# EasyEDA schematic SCH_dito_2026-01-28.json

## Sheets
1 Sheet_1: TITLE: Sheet_1; REV: 1.0; Date: 2026-01-20; Sheet: 1/1; Drawn By: siudin22; Company: Your Company
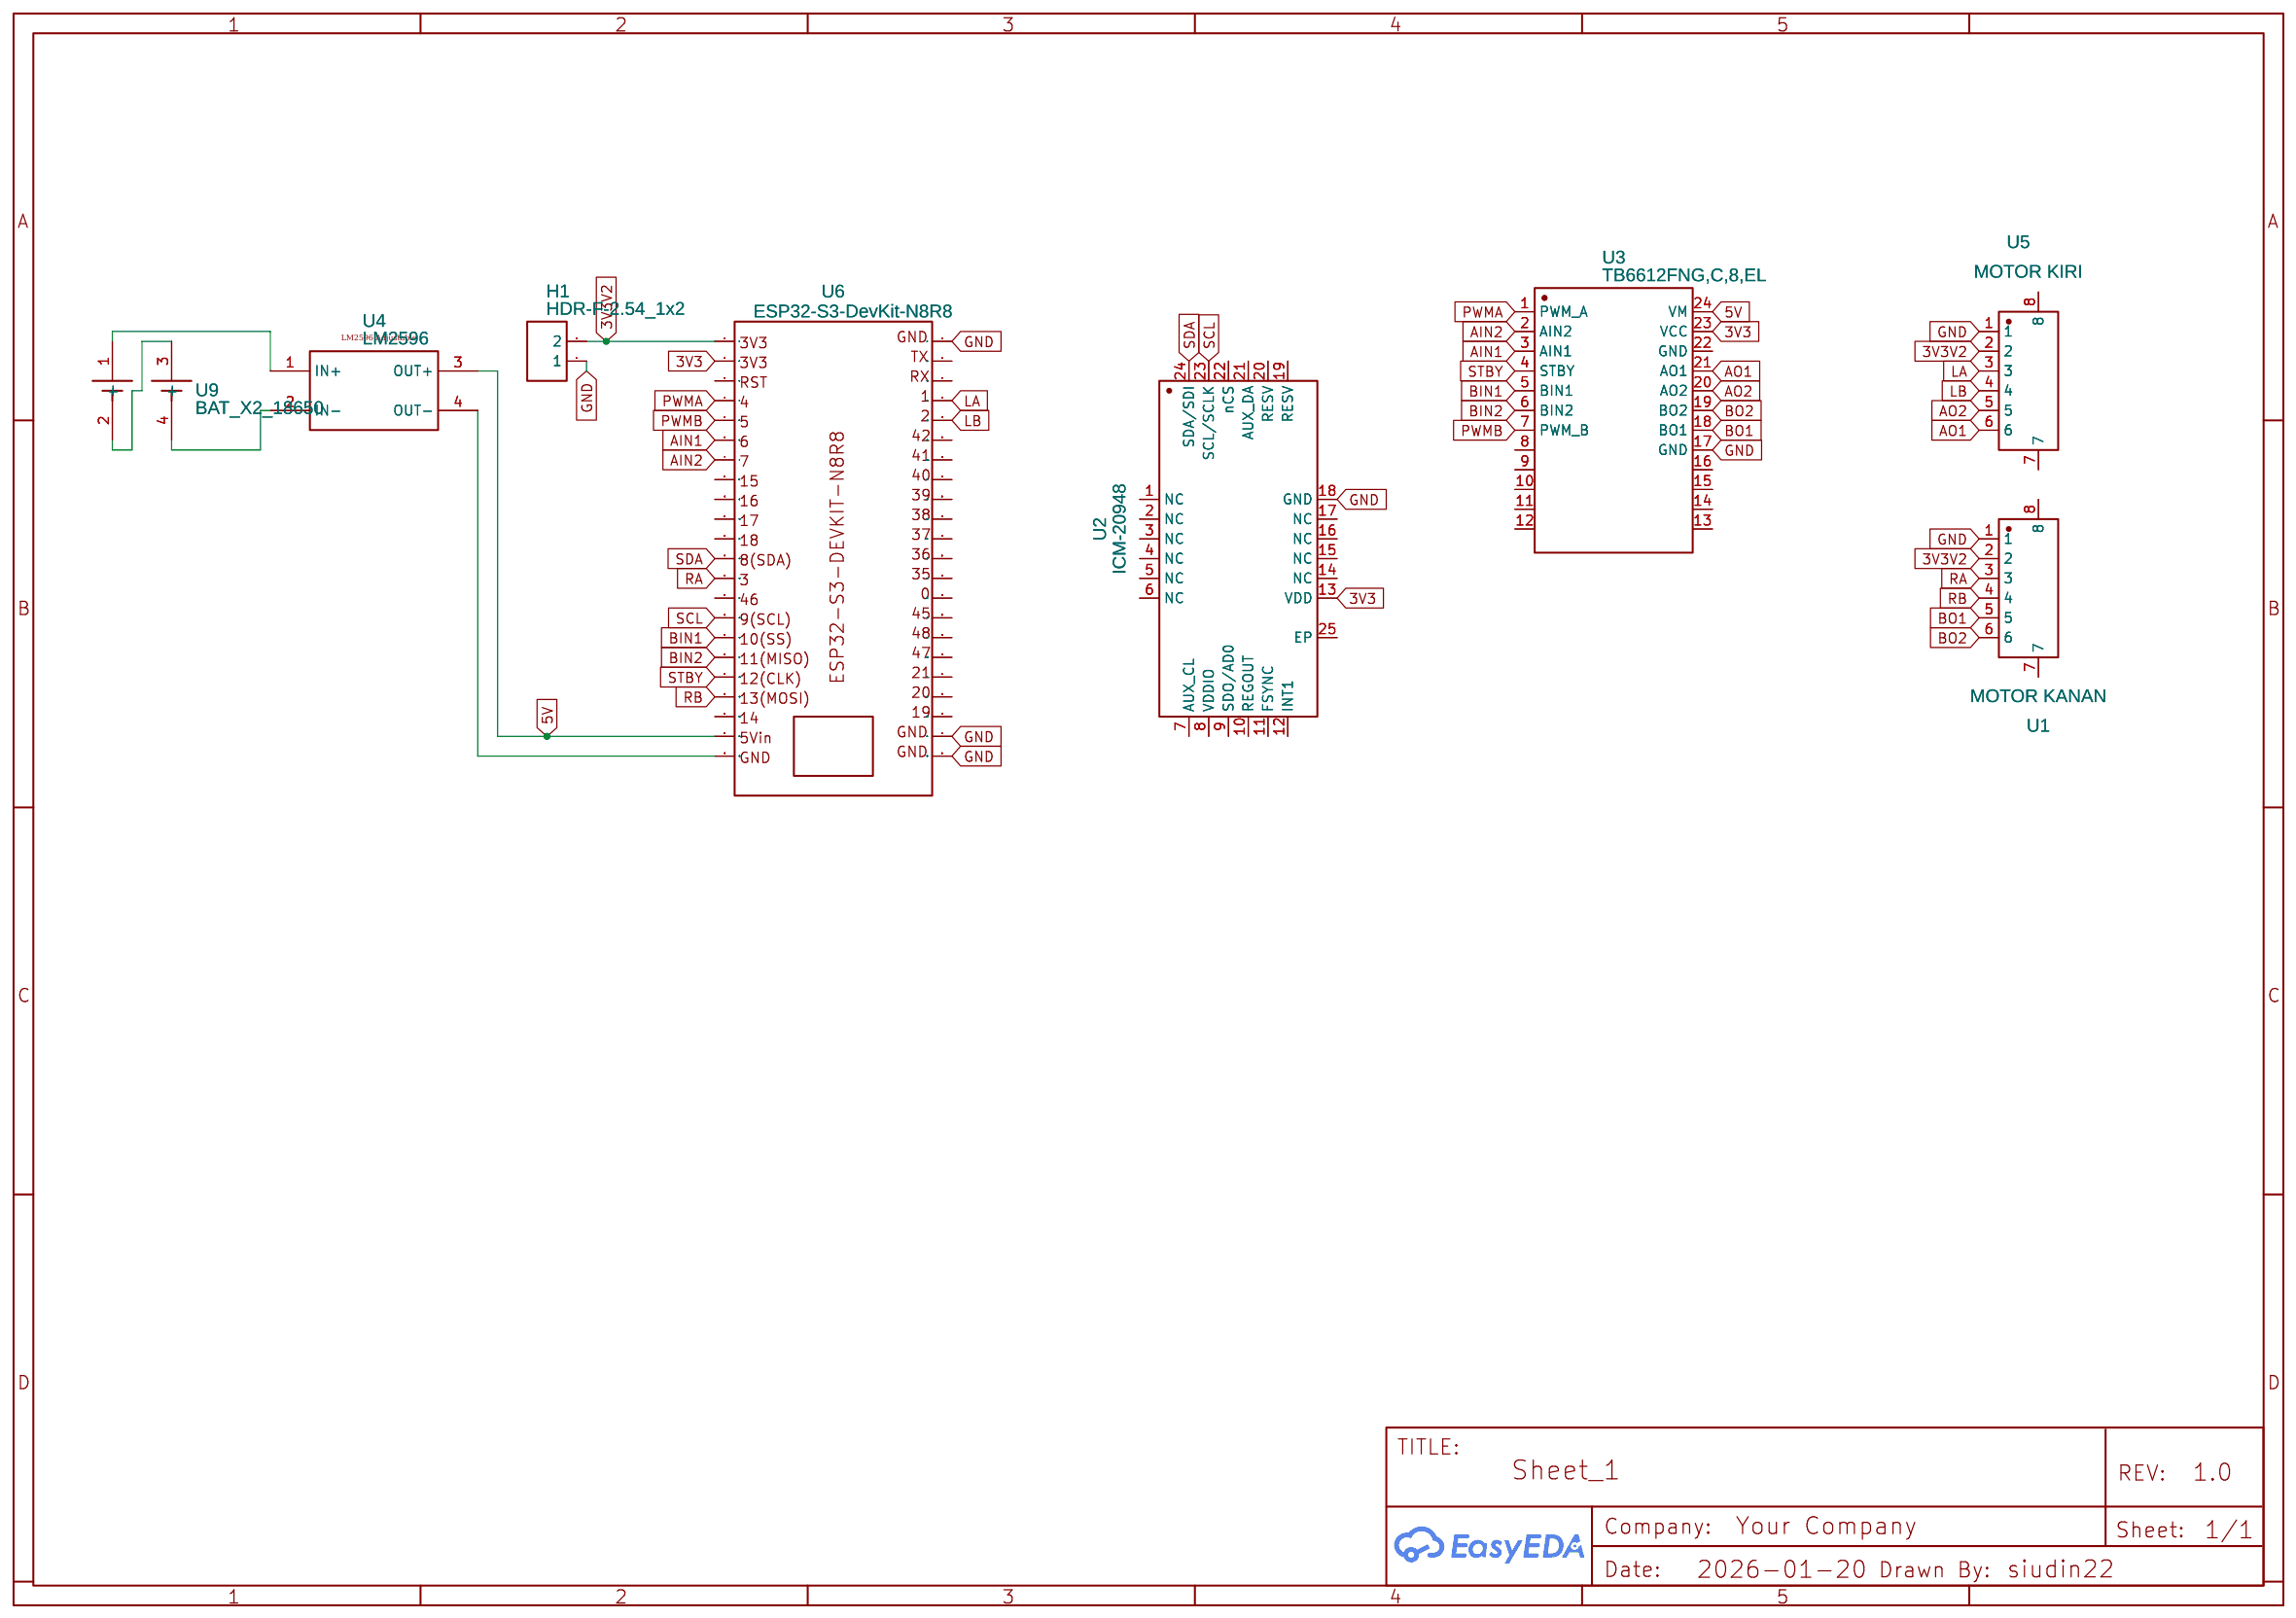
[diagram p0: Sheet_1]
2 Sheet_2: TITLE: Sheet_2; Date: 2026-01-22
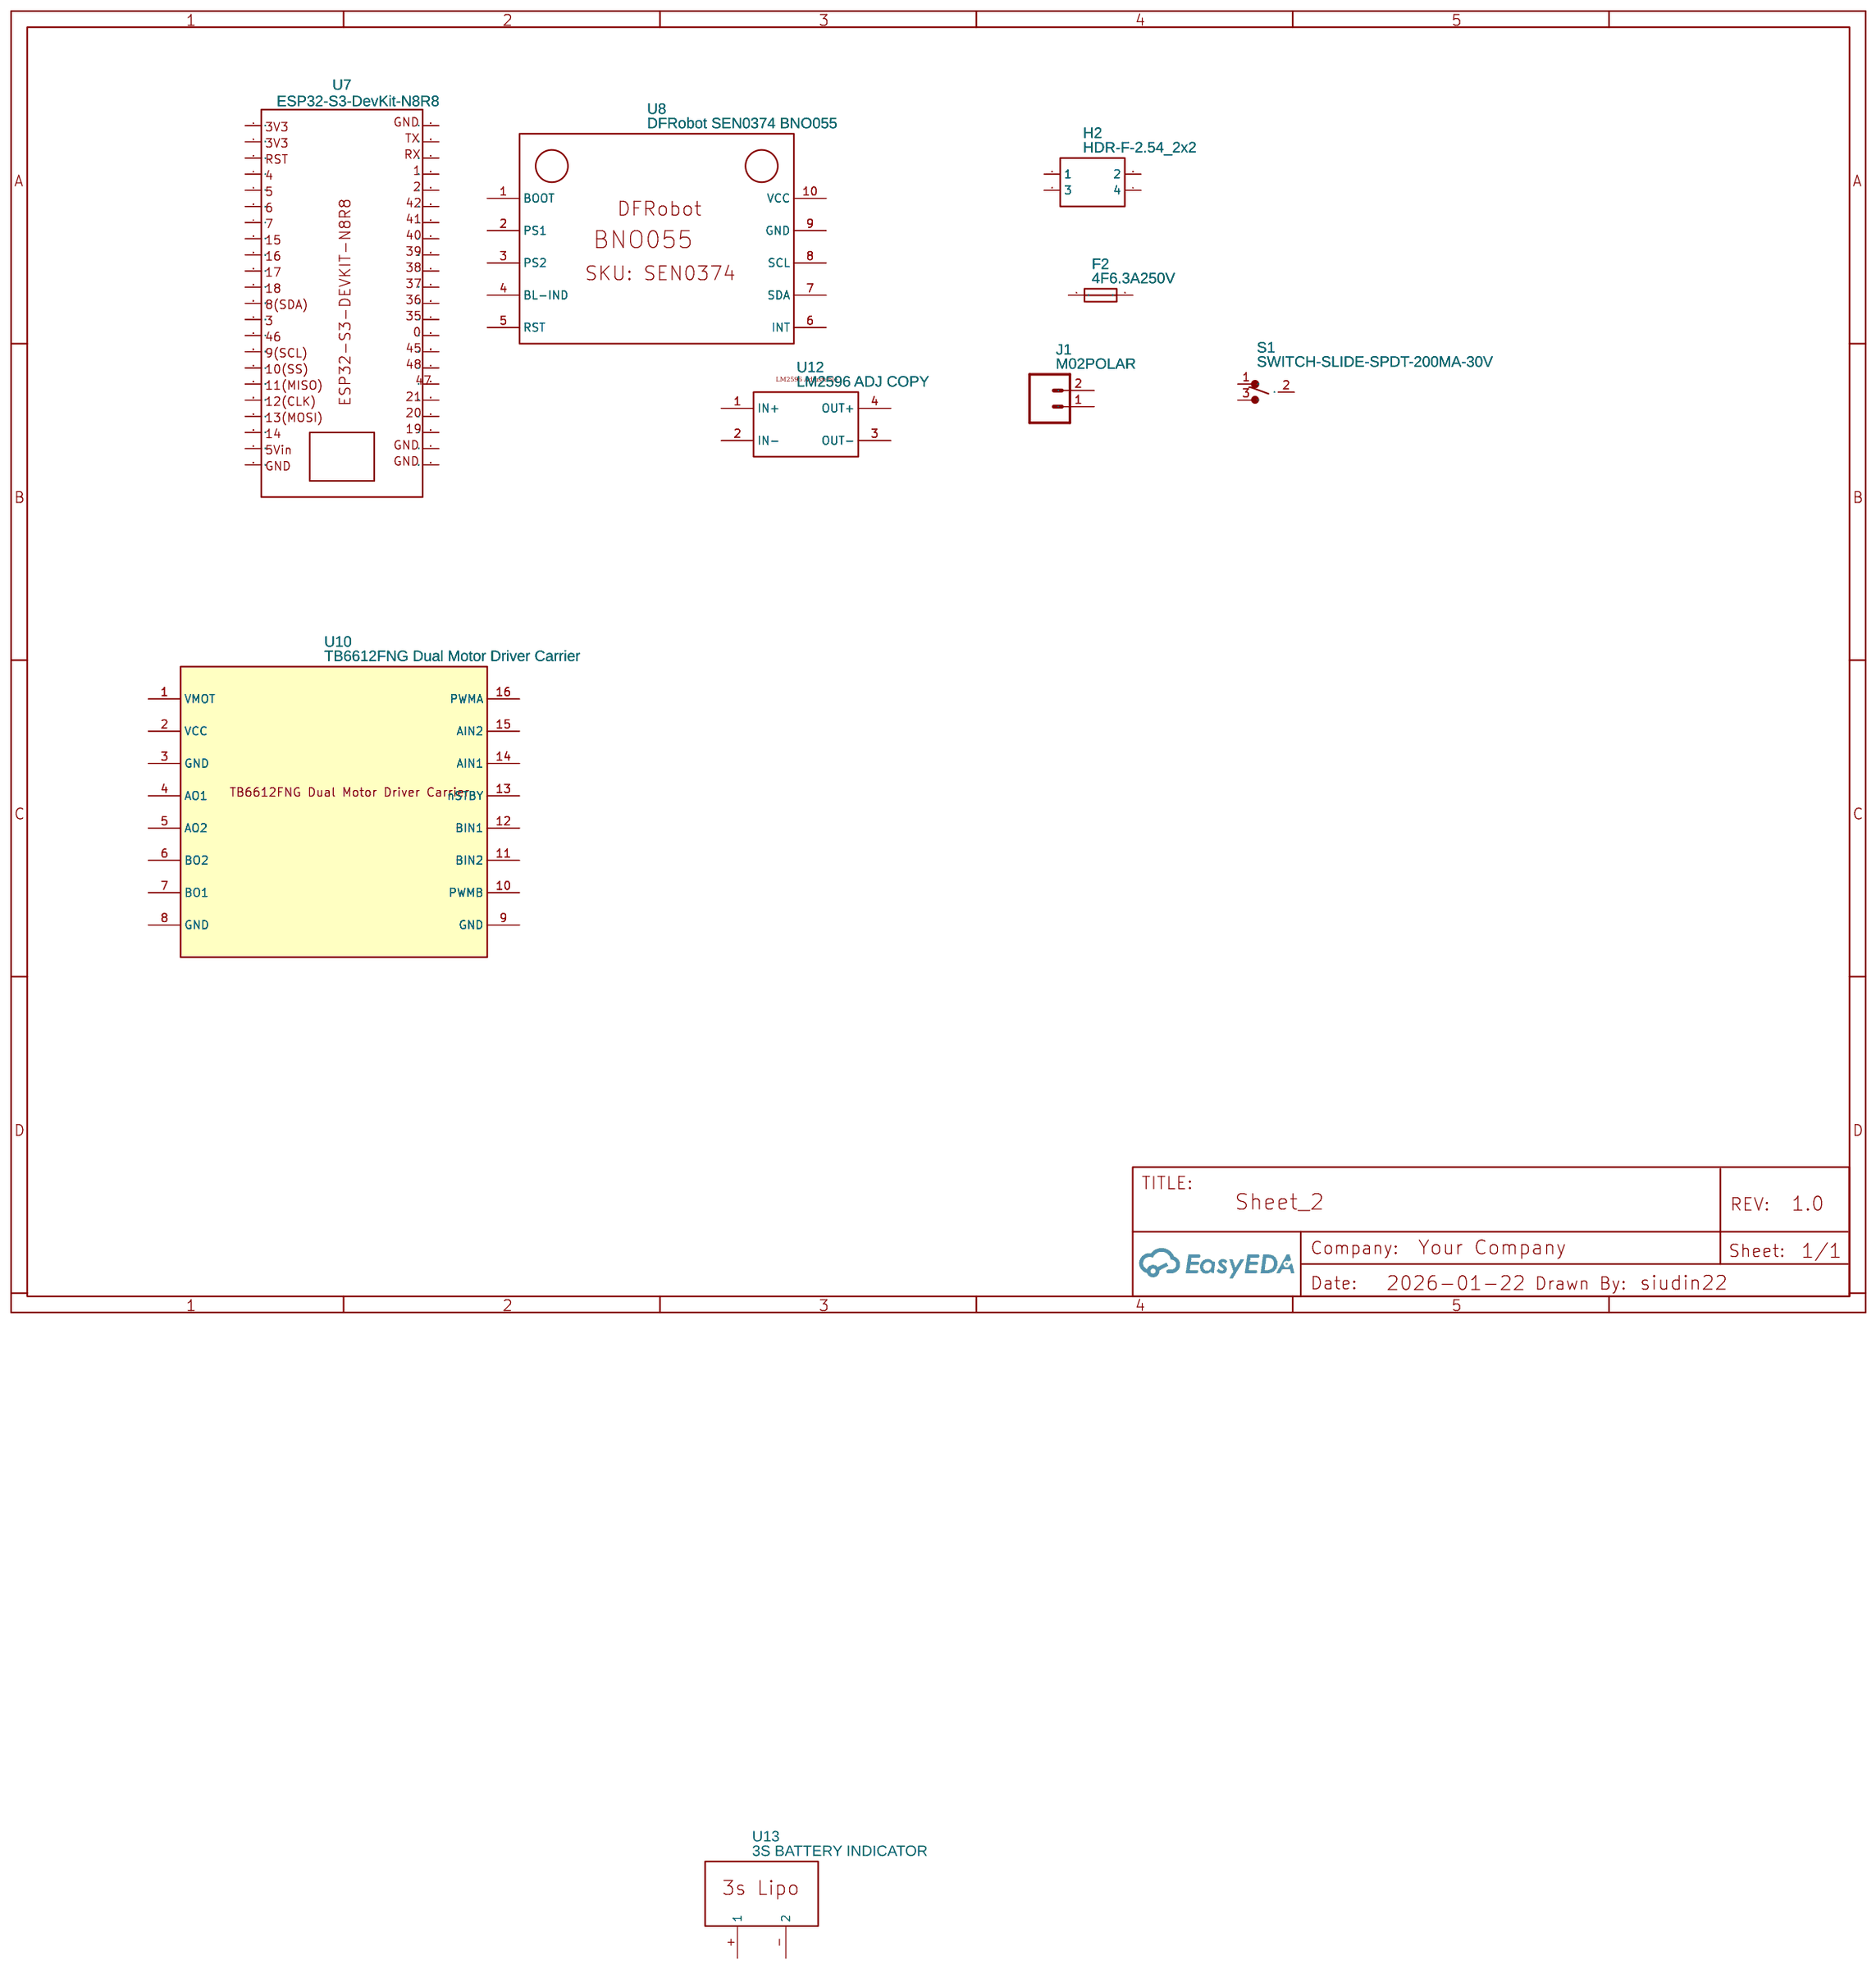
[diagram p1: Sheet_2]

## Parts
sheet Sheet_1
H1  HDR-F-2.54_1x2  [HDR-F-2.54_1X2]
U1  MOTOR KANAN  [CONN-SMD_6P-P1.00_XYECONN_XY-SH1.0-6A61]
U2  ICM-20948  [QFN-24_L3.0-W3.0-P0.40-BL-EP]
U3  TB6612FNG,C,8,EL  [SSOP-24_L8.3-W5.6-P0.65-LS7.6-BL]
U4  LM2596  [LM2596:YAAJ_DCDC_STEPDOWN_LM2596]
U5  MOTOR KIRI  [CONN-SMD_6P-P1.00_XYECONN_XY-SH1.0-6A61]
U6  ESP32-S3-DevKit-N8R8  [ESP32-S3-DEVKIT-N8R8]
U9  BAT_X2_18650  [BAT_X2_18650_ROUN_PAD_72X19]
sheet Sheet_2
F2  4F6.3A250V  [FUSE-TH_BD4.0-L11.0-P15.00-D0.6]
H2  HDR-F-2.54_2x2  [HDR-F-2.54_2X2]
J1  M02POLAR  [MOLEX-1X2]
S1  SWITCH-SLIDE-SPDT-200MA-30V  [SWITCH-ESWITCH-SLIDE-TH-EG1218]
U7  ESP32-S3-DevKit-N8R8  [ESP32-S3-DEVKIT-N8R8]
U8  DFRobot SEN0374 BNO055  [FOOTPRINT DFROBOT SEN0374 BNO055]
U10  TB6612FNG Dual Motor Driver Carrier  [TB6612FNG]
U12  LM2596 ADJ COPY  [LM2596:YAAJ_DCDC_STEPDOWN_LM2596]
U13  3S BATTERY INDICATOR  [3S LIPO BATTERY INDICATOR]

## Library data of the parts
H1 = HDR-F-2.54_1x2: Supplier Part: C49661; Supplier: LCSC; Contributor: LCEDA_Lib
U1 U5 = XY-SH1.0-6A61: Supplier: LCSC; Supplier Part: C19272000; Manufacturer: XYECONN(辛译); Contributor: lcsc
U2 = ICM-20948: Contributor: lcsc; Supplier: LCSC; Supplier Part: C726001; Manufacturer: TDK InvenSense(应美盛); JLCPCB Part Class: Extended Part
U3 = TB6612FNG,C,8,EL: Contributor: LCSC; Supplier: LCSC; Manufacturer: TOSHIBA(东芝); Supplier Part: C141517; JLCPCB Part Class: Extended Part
U4 = BuckConverters_LM2596_Adj: Servo 5V; Add into BOM: yes; Convert to PCB: yes; Origin Footprint: YAAJ_DCDC_StepDown_LM2596; Contributor: ee22b001
U6 U7 = ESP32-S3-DevKit-N8R8: Manufacturer: WaveShare; Supplier: Mouser; link: https://www.waveshare.com/wiki/ESP32-S3-DEV-KIT-N8R8; Contributor: robciog1968
U9 = BAT_X2_18650: Manufacturer: Dex; Supplier: Dex; Supplier Part: BAT_X2; Contributor: DexterityG
F2 = 4F6.3A250V: Contributor: lcsc; Supplier: LCSC; Supplier Part: C2905522; Manufacturer: xcfuse(旭程); JLCPCB Part Class: Extended Part
H2 = HDR-F-2.54_2x2: Supplier Part: C239342; Supplier: LCSC; Contributor: LCEDA_Lib
J1 = M02POLAR: Contributor: firefalc0n
S1 = SWITCH-SLIDE-SPDT-200MA-30V: Contributor: gokmenim
U8 = DFRobot SEN0374 BNO055: Contributor: huynhquoctoan26
U10 = TB6612FNG Dual Motor Driver Carrier: Contributor: jazmin.trejo.p; sourceId: YsmgyP7pj; Mounted: Yes
U12 = BuckConverters_LM2596_Adj: Servo 5V; Add into BOM: yes; Convert to PCB: yes; Origin Footprint: YAAJ_DCDC_StepDown_LM2596; Contributor: ottello
U13 = 3S BATTERY INDICATOR: Contributor: Atly Joy

## Nets
3V3: U2.13(VDD) U3.23(VCC) U6.2
3V3V2: H1.2 U1.2 U5.2 U6.1
5V: U3.24(VM) U4.3(OUT+) U6.21
GND: H1.1 U1.1 U2.18(GND) U3.17(GND) U5.1 U6.23 U6.24 U6.44
AIN1: U3.3(AIN1) U6.6
AIN2: U3.2(AIN2) U6.7
AO1: U3.21(AO1) U5.6
AO2: U3.20(AO2) U5.5
BIN1: U3.5(BIN1) U6.16
BIN2: U3.6(BIN2) U6.17
BO1: U1.5 U3.18(BO1)
BO2: U1.6 U3.19(BO2)
LA: U5.3 U6.41
LB: U5.4 U6.40
PWMA: U3.1(PWM A) U6.4
PWMB: U3.7(PWM B) U6.5
RA: U1.3 U6.13
RB: U1.4 U6.19
SCL: U2.23(SCL/SCLK) U6.15
SDA: U2.24(SDA/SDI) U6.12
STBY: U3.4(STBY) U6.18
Net-(U4-1): U4.1(IN+) U9.1(+)
Net-(U4-2): U4.2(IN-) U9.4(-)
Net-(U4-4): U4.4(OUT-) U6.22
Net-(U9-2): U9.2(-) U9.3(+)

Not connected (* = marked no-connect by the designer): F2 1 2; H2 1 2 3 4; J1 1 2; S1 1 2 3; U1 7 8; U2 1(NC) 2(NC) 3(NC) 4(NC) 5(NC) 6(NC) 7(AUX_CL) 8(VDDIO) 9(SDO/AD0) 10(REGOUT) 11(FSYNC) 12(INT1) 14(NC) 15(NC) 16(NC) 17(NC) 19(RESV) 20(RESV) 21(AUX_DA) 22(nCS) 25(EP); U3 8 9 10 11 12 13 14 15 16 22(GND); U5 7 8; U6 3 8 9 10 11 14 20 25 26 27 28 29 30 31 32 33 34 35 36 37 38 39 42 43; U7 1 2 3 4 5 6 7 8 9 10 11 12 13 14 15 16 17 18 19 20 21 22 23 24 25 26 27 28 29 30 31 32 33 34 35 36 37 38 39 40 41 42 43 44; U8 1(BOOT) 2(PS1) 3(PS2) 4(BL-IND) 5(RST) 6(INT) 7(SDA) 8(SCL) 9(GND) 10(VCC); U10 1(VMOT) 2(VCC) 3(GND) 4(AO1) 5(AO2) 6(BO2) 7(BO1) 8(GND) 9(GND) 10(PWMB) 11(BIN2) 12(BIN1) 13(nSTBY) 14(AIN1) 15(AIN2) 16(PWMA); U12 1(IN+) 2(IN-) 3(OUT-) 4(OUT+); U13 +(1) -(2)
